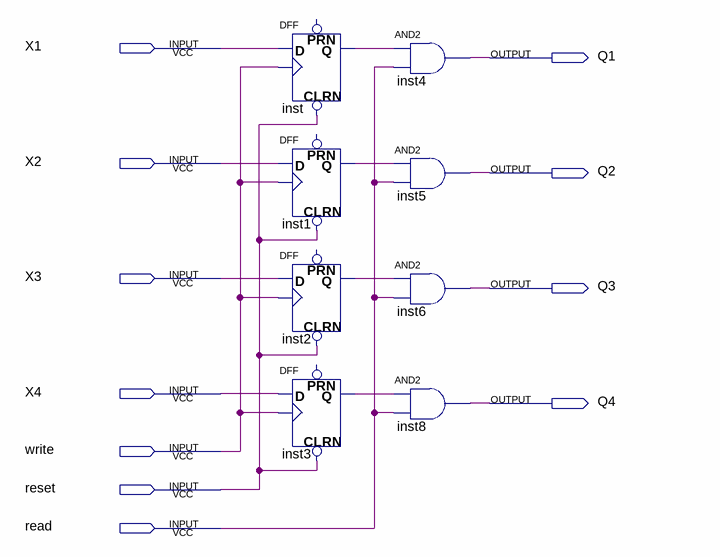
[diagram p0: schematic sheet]
// Quartus schematic point5.bdf as structural Verilog: 8 symbols, 11 pins
module point5 (
  input  X1,
  input  X2,
  input  X3,
  input  X4,
  input  write,
  input  reset,
  input  read,
  output Q1,
  output Q2,
  output Q3,
  output Q4
);

  wire inst1_q, inst2_q, inst3_q, inst_q;

  DFF inst (.CLRN(reset), .CLK(write), .D(X1), .Q(inst_q));  // open: PRN
  DFF inst1 (.CLRN(reset), .CLK(write), .D(X2), .Q(inst1_q));  // open: PRN
  DFF inst2 (.CLRN(reset), .CLK(write), .D(X3), .Q(inst2_q));  // open: PRN
  DFF inst3 (.CLRN(reset), .CLK(write), .D(X4), .Q(inst3_q));  // open: PRN
  and inst4 (Q1, inst_q, read);
  and inst5 (Q2, inst1_q, read);
  and inst6 (Q3, inst2_q, read);
  and inst8 (Q4, inst3_q, read);
endmodule
